# EAGLE schematic EDCPSUMK1-RP2040-USBC (EAGLE 9.6.2)
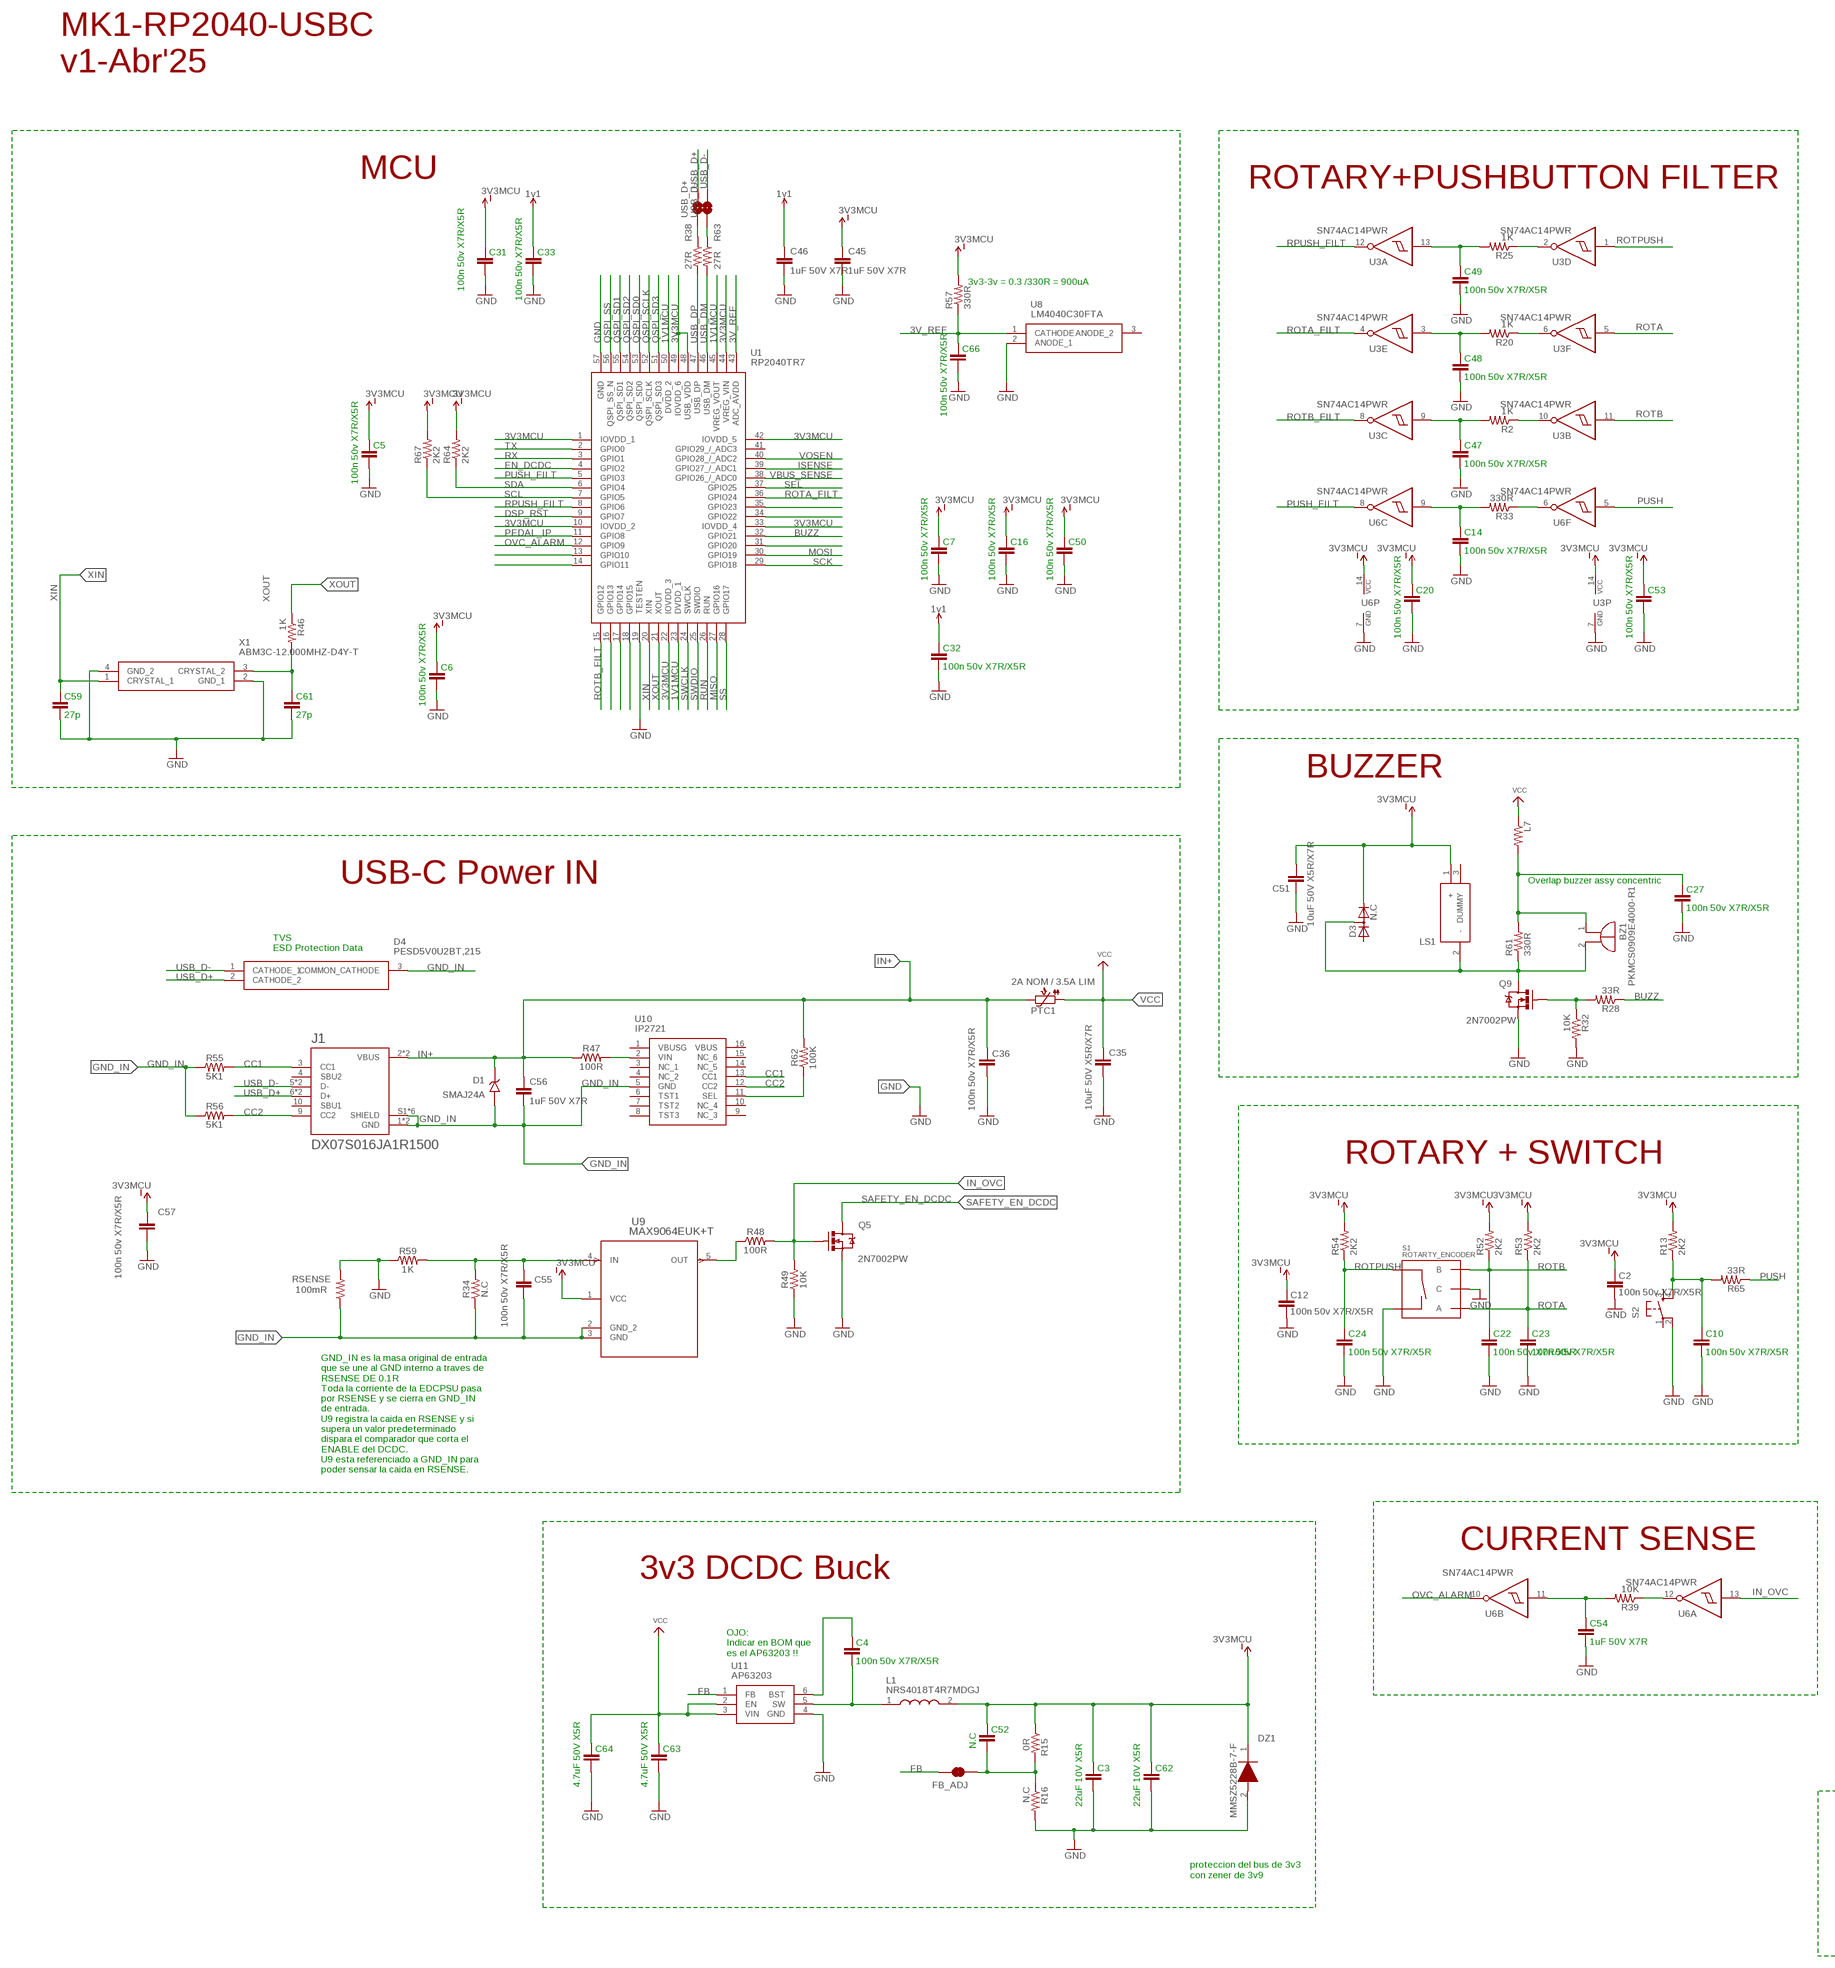
[diagram p0: schematic, sheet 1, part 1 of 2]
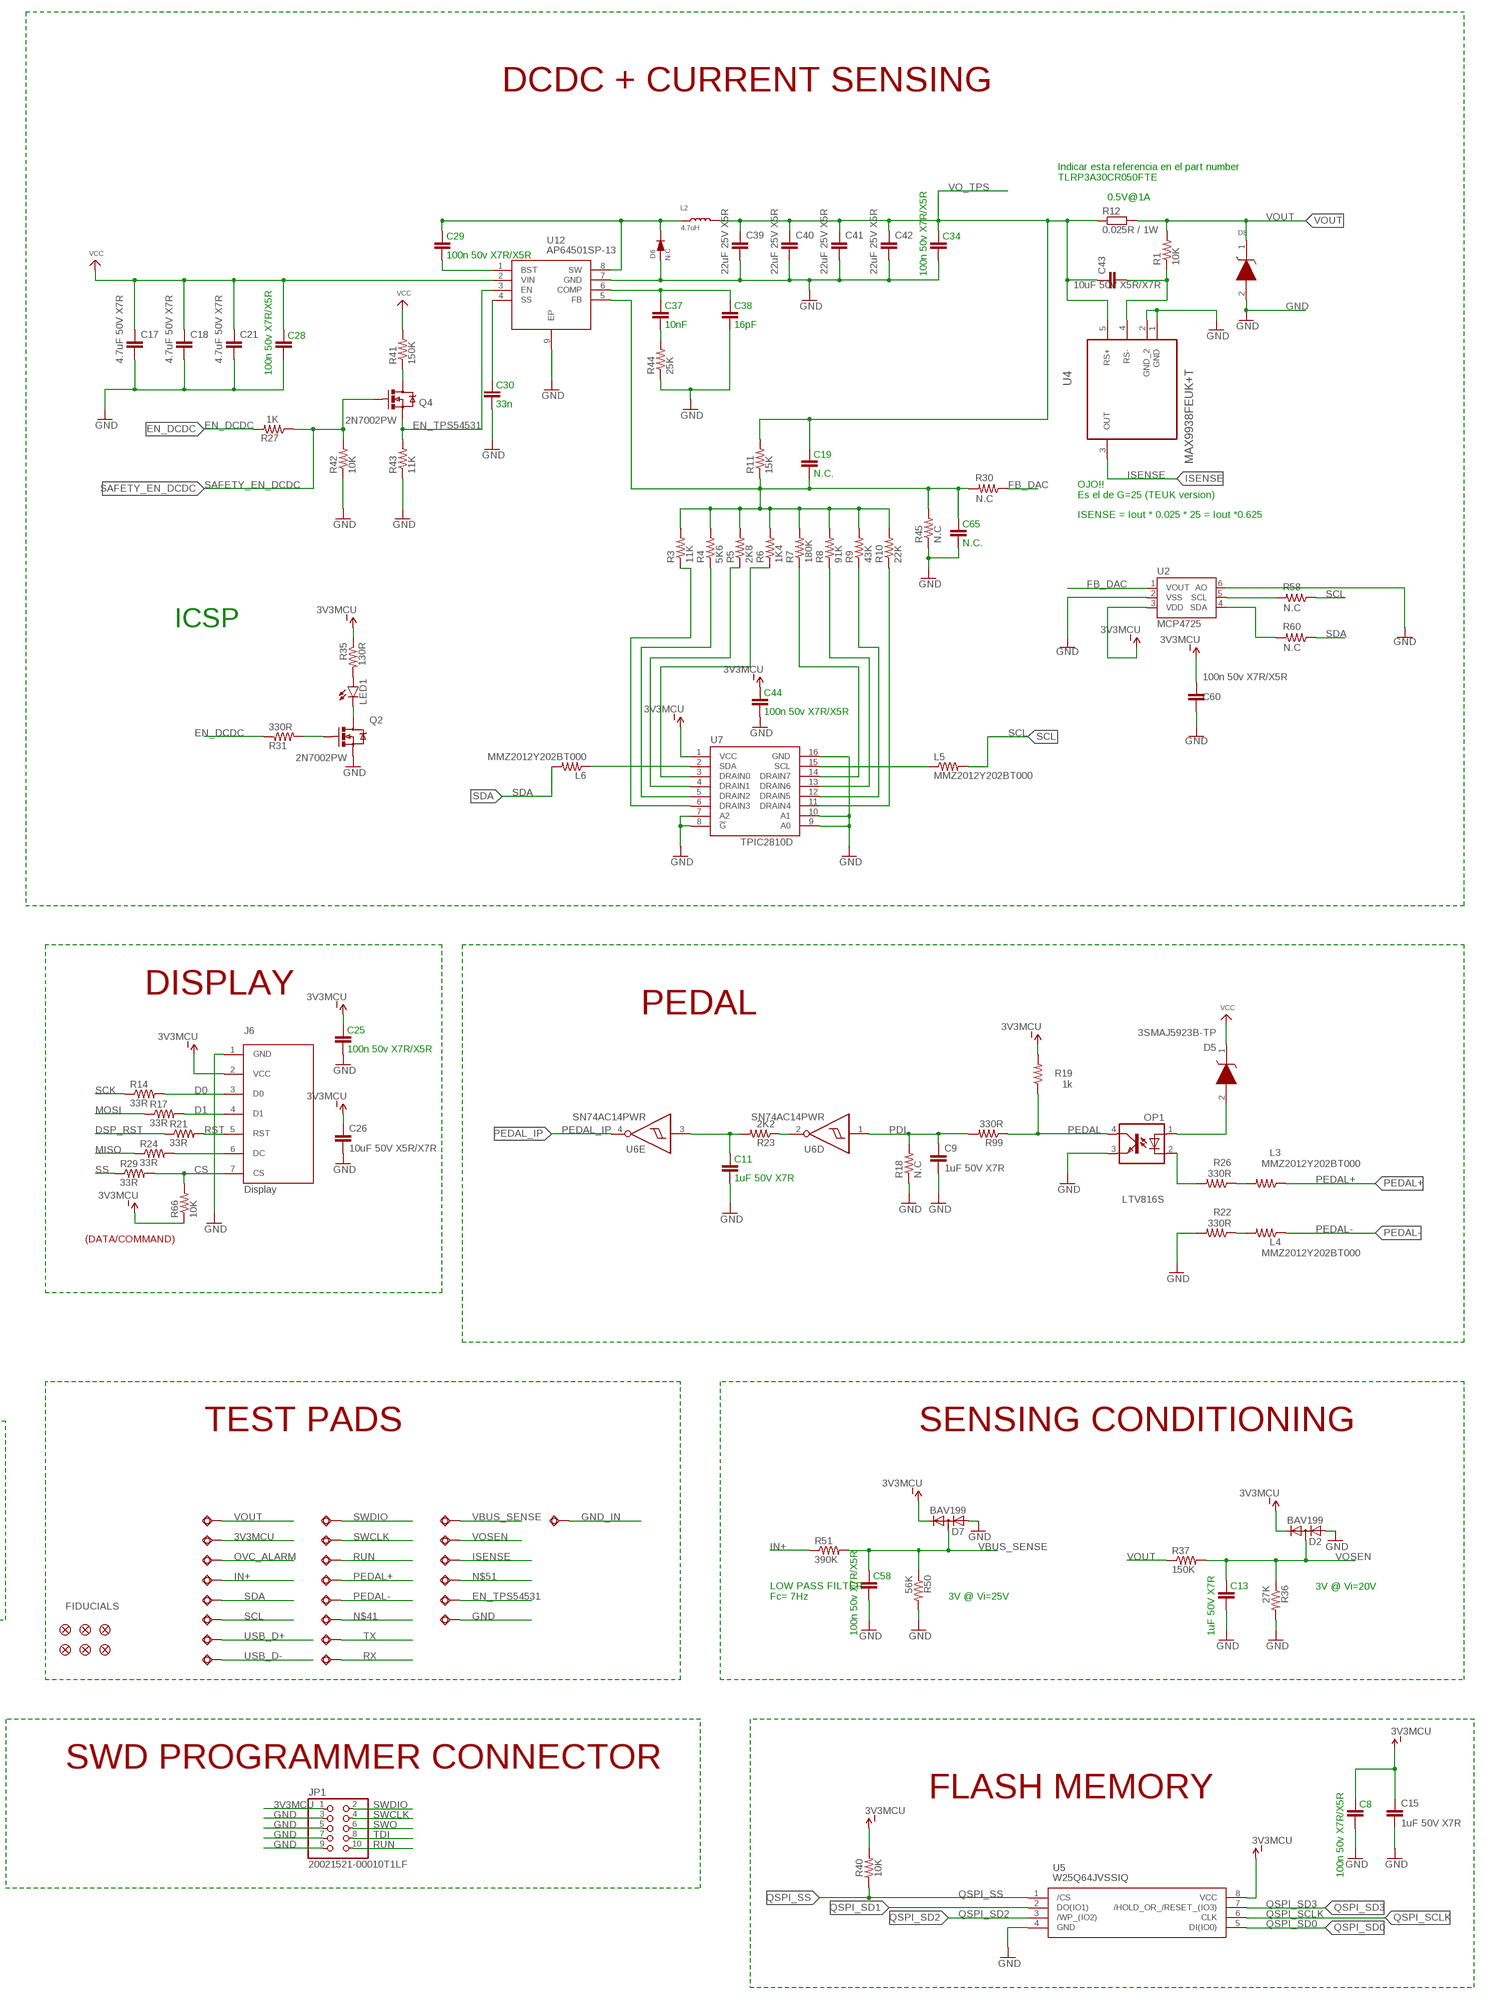
[diagram p1: schematic, sheet 1, part 2 of 2]

## Parts
3V3MCU  TESTPAD_TPSQB1,27  [TESTPAD_B1,27]
BZ1  PKMCS0909E4000-R1  [PKMCS0909]
C2  100n 50v X7R/X5R  CAP0805  [0805]
C3  22uF 10V X5R  CAP0805  [0805]
C4  100n 50v X7R/X5R  CAP0805  [0805]
C5  100n 50v X7R/X5R  CAP0805  [0805]
C6  100n 50v X7R/X5R  CAP0805  [0805]
C7  100n 50v X7R/X5R  CAP0805  [0805]
C8  100n 50v X7R/X5R  CAP0805  [0805]
C9  1uF 50V X7R  CAP0805  [0805]
C10  100n 50v X7R/X5R  CAP0805  [0805]
C11  1uF 50V X7R  CAP0805  [0805]
C12  100n 50v X7R/X5R  CAP0805  [0805]
C13  1uF 50V X7R  CAP0805  [0805]
C14  100n 50v X7R/X5R  CAP0805  [0805]
C15  1uF 50V X7R  CAP0805  [0805]
C16  100n 50v X7R/X5R  CAP0805  [0805]
C17  4.7uF 50V X7R  CAP1210  [1210]
C18  4.7uF 50V X7R  CAP1210  [1210]
C19  N.C.  CAP0805  [0805]
C20  100n 50v X7R/X5R  CAP0805  [0805]
C21  4.7uF 50V X7R  CAP1210  [1210]
C22  100n 50v X7R/X5R  CAP0805  [0805]
C23  100n 50v X7R/X5R  CAP0805  [0805]
C24  100n 50v X7R/X5R  CAP0805  [0805]
C25  100n 50v X7R/X5R  CAP0805  [0805]
C26  10uF 50V X5R/X7R  CAP1206  [1206]
C27  100n 50v X7R/X5R  CAP0805  [0805]
C28  100n 50v X7R/X5R  CAP0805  [0805]
C29  100n 50v X7R/X5R  CAP0805  [0805]
C30  33n  CAP0805  [0805]
C31  100n 50v X7R/X5R  CAP0805  [0805]
C32  100n 50v X7R/X5R  CAP0805  [0805]
C33  100n 50v X7R/X5R  CAP0805  [0805]
C34  100n 50v X7R/X5R  CAP0805  [0805]
C35  10uF 50V X5R/X7R  CAP1206  [1206]
C36  100n 50v X7R/X5R  CAP0805  [0805]
C37  10nF  CAP0805  [0805]
C38  16pF  CAP0805  [0805]
C39  22uF 25V X5R  CAP1210  [1210]
C40  22uF 25V X5R  CAP1210  [1210]
C41  22uF 25V X5R  CAP1210  [1210]
C42  22uF 25V X5R  CAP1210  [1210]
C43  10uF 50V X5R/X7R  CAP1206  [1206]
C44  100n 50v X7R/X5R  CAP0805  [0805]
C45  1uF 50V X7R  CAP0805  [0805]
C46  1uF 50V X7R  CAP0805  [0805]
C47  100n 50v X7R/X5R  CAP0805  [0805]
C48  100n 50v X7R/X5R  CAP0805  [0805]
C49  100n 50v X7R/X5R  CAP0805  [0805]
C50  100n 50v X7R/X5R  CAP0805  [0805]
C51  10uF 50V X5R/X7R  CAP1206  [1206]
C52  N.C  CAP0805  [0805]
C53  100n 50v X7R/X5R  CAP0805  [0805]
C54  1uF 50V X7R  CAP0805  [0805]
C55  100n 50v X7R/X5R  CAP0805  [0805]
C56  1uF 50V X7R  CAP0805  [0805]
C57  100n 50v X7R/X5R  CAP0805  [0805]
C58  100n 50v X7R/X5R  CAP0805  [0805]
C59  27p  CAP0805  [0805]
C60  100n 50v X7R/X5R  CAP0805  [0805]
C61  27p  CAP0805  [0805]
C62  22uF 10V X5R  CAP0805  [0805]
C63  4.7uF 50V X5R  CAP0805  [0805]
C64  4.7uF 50V X5R  CAP0805  [0805]
C65  N.C.  CAP0805  [0805]
C66  100n 50v X7R/X5R  CAP0805  [0805]
D1  SMAJ24A  3SMAJ5934B  [DIOM4325X244N]
D2  BAV199  [SOT23]
D3  N.C  BAV199  [SOT23]
D4  PESD5V0U2BT,215  [SOT95P230X110-3N]
D5  3SMAJ5923B-TP  [DIOM5226X244N]
D6  N.C  DSMC  [DO-214AB]
D7  BAV199  [SOT23]
D8  RB060M-60TR  3SMAJ5923B-TP  [DIOM5226X244N]
DZ1  MMSZ5228B-7-F  [SODFL3518X115N]
EN_TPS54531  TESTPAD_TPSQB1,27  [TESTPAD_B1,27]
FB_ADJ  JUMPER-SMT_2_NC_TRACE_NO-SILK  [SMT-JUMPER_2_NC_TRACE_NO-SILK]
FID1  FIDUCIAL1X2  [FIDUCIAL-1X2]
FID2  FIDUCIAL1X2  [FIDUCIAL-1X2]
FID3  FIDUCIAL1X2  [FIDUCIAL-1X2]
FID4  FIDUCIAL1X2  [FIDUCIAL-1X2]
FID5  FIDUCIAL1X2  [FIDUCIAL-1X2]
FID6  FIDUCIAL1X2  [FIDUCIAL-1X2]
GND  TESTPAD_TPSQB1,27  [TESTPAD_B1,27]
GND_IN  TESTPAD_TPSQB1,27  [TESTPAD_B1,27]
IN+  TESTPAD_TPSQB1,27  [TESTPAD_B1,27]
ISENSE  TESTPAD_TPSQB1,27  [TESTPAD_B1,27]
J1  DX07S016JA1R1500  [JAE_DX07S016JA1R1500]
J6  Display  OLED_LCD  [OLED_LCD]
JP1  20021521-00010T1LF  [20021521-00010T1LF]
L1  NRS4018T4R7MDGJ  [NRS4018T100MDGJ]
L2  4.7uH  L74437368047  [WE-LHMI]
L3  MMZ2012Y202BT000  RESISTOR0805-RES  [0805]
L4  MMZ2012Y202BT000  RESISTOR0805-RES  [0805]
L5  MMZ2012Y202BT000  RESISTOR0805-RES  [0805]
L6  MMZ2012Y202BT000  RESISTOR0805-RES  [0805]
L7  MMZ2012Y202BT000  RESISTOR0805-RES  [0805]
LED1  LED3MM  [LED3MM]
LS1  SMT-0540-S-R  [SMT0540SR]
N$41  TESTPAD_TPSQB1,27  [TESTPAD_B1,27]
N$51  TESTPAD_TPSQB1,27  [TESTPAD_B1,27]
OP1  LTV816S  [SMD4]
OVC_ALARM  TESTPAD_TPSQB1,27  [TESTPAD_B1,27]
PEDAL+  TESTPAD_TPSQB1,27  [TESTPAD_B1,27]
PEDAL-  TESTPAD_TPSQB1,27  [TESTPAD_B1,27]
PTC1  2A NOM / 3.5A LIM  PTC-  [1812L]
Q2  2N7002PW  MOSFET-NCHANNEL2N7002PW  [SOT323]
Q4  2N7002PW  MOSFET-NCHANNEL2N7002PW  [SOT323]
Q5  2N7002PW  MOSFET-NCHANNEL2N7002PW  [SOT323]
Q9  2N7002PW  MOSFET-NCHANNEL2N7002PW  [SOT323]
R1  10K  RESISTOR0805  [0805]
R2  1K  RESISTOR0805  [0805]
R3  11K  RESISTOR0805  [0805]
R4  5K6  RESISTOR0805  [0805]
R5  2K8  RESISTOR0805  [0805]
R6  1K4  RESISTOR0805  [0805]
R7  180K  RESISTOR0805  [0805]
R8  91K  RESISTOR0805  [0805]
R9  43K  RESISTOR0805  [0805]
R10  22K  RESISTOR0805  [0805]
R11  15K  RESISTOR0805  [0805]
R12  0.025R / 1W  RR2512  [R2512]
R13  2K2  RESISTOR0805  [0805]
R14  33R  RESISTOR0805  [0805]
R15  0R  RESISTOR0805  [0805]
R16  N.C  RESISTOR0805  [0805]
R17  33R  RESISTOR0805  [0805]
R18  N.C  RESISTOR0805  [0805]
R19  1k  RESISTOR0805  [0805]
R20  1K  RESISTOR0805  [0805]
R21  33R  RESISTOR0805  [0805]
R22  330R  RESISTOR0805  [0805]
R23  2K2  RESISTOR0805  [0805]
R24  33R  RESISTOR0805  [0805]
R25  1K  RESISTOR0805  [0805]
R26  330R  RESISTOR0805  [0805]
R27  1K  RESISTOR0805  [0805]
R28  33R  RESISTOR0805  [0805]
R29  33R  RESISTOR0805  [0805]
R30  N.C  RESISTOR0805  [0805]
R31  330R  RESISTOR0805  [0805]
R32  10K  RESISTOR0805  [0805]
R33  330R  RESISTOR0805  [0805]
R34  N.C  RESISTOR0805  [0805]
R35  130R  RESISTOR0805  [0805]
R36  27K  RESISTOR0805  [0805]
R37  150K  RESISTOR0805  [0805]
R38  27R  RESISTOR0805  [0805]
R39  10K  RESISTOR0805  [0805]
R40  10K  RESISTOR0805  [0805]
R41  150K  RESISTOR0805  [0805]
R42  10K  RESISTOR0805  [0805]
R43  11K  RESISTOR0805  [0805]
R44  25K  RESISTOR0805  [0805]
R45  N.C  RESISTOR0805  [0805]
R46  1K  RESISTOR0805  [0805]
R47  100R  RESISTOR0805  [0805]
R48  100R  RESISTOR0805  [0805]
R49  10K  RESISTOR0805  [0805]
R50  56K  RESISTOR0805  [0805]
R51  390K  RESISTOR0805  [0805]
R52  2K2  RESISTOR0805  [0805]
R53  2K2  RESISTOR0805  [0805]
R54  2K2  RESISTOR0805  [0805]
R55  5K1  RESISTOR0805  [0805]
R56  5K1  RESISTOR0805  [0805]
R57  330R  RESISTOR0805  [0805]
R58  N.C  RESISTOR0805  [0805]
R59  1K  RESISTOR0805  [0805]
R60  N.C  RESISTOR0805  [0805]
R61  330R  RESISTOR0805  [0805]
R62  100K  RESISTOR0805  [0805]
R63  27R  RESISTOR0805  [0805]
R64  2K2  RESISTOR0805  [0805]
R65  33R  RESISTOR0805  [0805]
R66  10K  RESISTOR0805  [0805]
R67  2K2  RESISTOR0805  [0805]
R99  330R  RESISTOR0805  [0805]
RSENSE  100mR  RESISTOR1206  [1206]
RUN  TESTPAD_TPSQB1,27  [TESTPAD_B1,27]
RX  TESTPAD_TPSQB1,27  [TESTPAD_B1,27]
S1  ROTARTY_ENCODER  [ROTARY_ENC_PLAIN]
S2  TAC_SWITCH_KSC931G-SMD  [TAC_SW_SMD_KSC931G]
SCL  TESTPAD_TPSQB1,27  [TESTPAD_B1,27]
SDA  TESTPAD_TPSQB1,27  [TESTPAD_B1,27]
SWCLK  TESTPAD_TPSQB1,27  [TESTPAD_B1,27]
SWDIO  TESTPAD_TPSQB1,27  [TESTPAD_B1,27]
TX  TESTPAD_TPSQB1,27  [TESTPAD_B1,27]
U1  RP2040TR7  [RP2040TR7]
U2  MCP4725  MCP4725SOT-23  [SOT23-6]
U3  SN74AC14PWR  7414  [TSSOP14]
U4  MAX9938FEUK+T  [SOT95P280X145-5N]
U5  W25Q64JVSSIQ  [SOIC127P790X216-8N]
U6  SN74AC14PWR  7414  [TSSOP14]
U7  TPIC2810D  [SO16]
U8  LM4040C30FTA  [SOT96P240X120-3N]
U9  MAX9064EUK+T  [21-0057F_MXM]
U10  IP2721  [SOP65P640X120-16N]
U11  AP63203  AP63201WU-7  [SOT95P280X100-6N]
U12  AP64501SP-13  [SOIC127P600X163-9N]
USB-D+  TESTPAD_TPSQB1,27  [TESTPAD_B1,27]
USB-D-  TESTPAD_TPSQB1,27  [TESTPAD_B1,27]
USB_D+  JUMPER-SMT_2_NO_NO-SILK  [SMT-JUMPER_2_NO_NO-SILK]
USB_D-  JUMPER-SMT_2_NO_NO-SILK  [SMT-JUMPER_2_NO_NO-SILK]
VBUS_SENSE  TESTPAD_TPSQB1,27  [TESTPAD_B1,27]
VOSEN  TESTPAD_TPSQB1,27  [TESTPAD_B1,27]
VOUT  TESTPAD_TPSQB1,27  [TESTPAD_B1,27]
X1  ABM3C-12.000MHZ-D4Y-T  [ABM3C16000MHZD4YT]

## Nets
1V1MCU: C32.2 C33.2 C46.1 U1.23(DVDD_1) U1.45(VREG_VOUT) U1.50(DVDD_2) ; supply symbol labelled 1v1
3V3MCU: 3V3MCU.TP C2.2 C3.2 C5.2 C6.2 C7.2 C8.2 C12.2 C15.1 C16.2 C20.2 C25.2 C26.1 C31.2 C44.2 C45.1 C50.2 C51.2 C52.2 C53.2 C57.1 C60.2 C62.2 D2.2(C) D3.2(C) D7.2(C) DZ1.1(K) J6.2(VCC) JP1.1 L1.2 LS1.1(+) R13.2 R15.1 R19.2 R35.1 R40.2 R52.2 R53.2 R54.2 R57.2 R64.2 R66.1 R67.2 U1.1(IOVDD_1) U1.10(IOVDD_2) U1.22(IOVDD_3) U1.33(IOVDD_4) U1.42(IOVDD_5) U1.44(VREG_VIN) U1.48(USB_VDD) U1.49(IOVDD_6) U2.3(VDD) U3.14(P:VCC) U5.8(VCC) U6.14(P:VCC) U7.1(VCC) U9.1(VCC)
3V_REF: C66.2 R57.1 U1.43(ADC_AVDD) U8.1(CATHODE)
BUZZ: R28.1 U1.32(GPIO21)
CC1: J1.3(CC1) R55.2 U10.13(CC1)
CC2: J1.9(CC2) R56.2 U10.12(CC2)
CS: J6.7(CS) R29.2 R66.2
D0: J6.3(D0) R14.2
D1: J6.4(D1) R17.2
DSP_RST: R21.1 U1.9(GPIO7)
EN_DCDC: R27.2 R31.1 U1.4(GPIO2)
EN_TPS54531: EN_TPS54531.TP Q4.2(S) R43.2 U12.3(EN)
FB: FB_ADJ.2 U11.1(FB)
FB_DAC: R30.1 U2.1(VOUT)
GND: C2.1 C3.1 C5.1 C6.1 C7.1 C8.1 C9.2 C10.1 C11.1 C12.1 C13.1 C14.1 C15.2 C16.1 C17.2 C18.2 C20.1 C21.2 C22.1 C23.1 C24.1 C25.1 C26.2 C27.1 C28.1 C30.1 C31.1 C32.1 C33.1 C34.1 C35.2 C36.1 C38.1 C39.2 C40.2 C41.2 C42.2 C44.1 C45.2 C46.2 C47.1 C48.1 C49.1 C50.1 C51.1 C53.1 C54.1 C57.2 C58.1 C59.1 C60.1 C61.1 C62.1 C63.1 C64.1 C65.1 C66.1 D2.1(A) D6.1(A) D7.1(A) D8.2(A) DZ1.2(A) GND.TP J6.1(GND) JP1.3 JP1.5 JP1.7 JP1.9 OP1.3(EMIT) Q2.2(S) Q5.2(S) Q9.2(S) R16.2 R18.1 R22.2 R32.2 R36.2 R42.1 R43.1 R44.1 R45.1 R49.1 R50.2 R59.1 RSENSE.2 S1.C S1.SW- S2.2 U1.19(TESTEN) U1.57(GND) U2.2(VSS) U2.6(AO) U3.7(P:GND) U4.1(GND) U4.2(GND_2) U5.4(GND) U6.7(P:GND) U7.7(A2) U7.8(!G) U7.9(A0) U7.10(A1) U7.16(GND) U8.2(ANODE_1) U11.4(GND) U12.7(GND) U12.9(EP) X1.2(GND_1) X1.4(GND_2)
GND_IN: C55.2 C56.2 D1.A D4.3(COMMON_CATHODE) GND_IN.TP J1.1(GND) J1.12(GND) J1.S1(SHIELD) J1.S2(SHIELD) J1.S3(SHIELD) J1.S4(SHIELD) J1.S5(SHIELD) J1.S6(SHIELD) R34.1 R55.1 R56.1 RSENSE.1 U9.2(GND_2) U9.3(GND) U10.5(GND)
IN+: C36.2 C56.1 D1.C(K) IN+.TP J1.2(VBUS) J1.11(VBUS) PTC1.2 R47.1 R51.1 R62.2
IN_OVC: Q5.1(G) R48.2 R49.2 U6.13(A:I)
ISENSE: ISENSE.TP U1.39(GPIO27_/_ADC1) U4.3(OUT)
MISO: R24.1 U1.27(GPIO16)
MOSI: R17.1 U1.30(GPIO19)
N$1: R3.1 U7.6(DRAIN3)
N$2: R4.1 U7.5(DRAIN2)
N$3: R5.1 U7.4(DRAIN1)
N$4: R6.1 U7.3(DRAIN0)
N$5: R7.1 U7.14(DRAIN7)
N$6: J6.6(DC) R24.2
N$7: R8.1 U7.13(DRAIN6)
N$8: R9.1 U7.12(DRAIN5)
N$9: R10.1 U7.11(DRAIN4)
N$10: C43.2 R1.1 U4.4(RS-)
N$11: LED1.A R35.2
N$12: LED1.K(C) Q2.3(D)
N$13: R33.1 U6.6(F:O)
N$14: R62.1 U10.11(SEL)
N$15: R39.1 U6.12(A:O)
N$16: D5.2(A) OP1.1(A)
N$17: C10.2 R13.1 R65.2 S2.4
N$18: C47.2 R2.2 U3.9(C:I)
N$19: C19.1 C65.2 R3.2 R4.2 R5.2 R6.2 R7.2 R8.2 R9.2 R10.2 R11.1 R30.2 R45.2 U12.5(FB)
N$20: Q9.1(G) R28.2 R32.1
N$21: Q2.1(G) R31.2
N$22: R2.1 U3.10(B:O)
N$23: R20.1 U3.6(F:O)
N$25: R25.1 U3.2(D:O)
N$26: C49.2 R25.2 U3.13(A:I)
N$28: C48.2 R20.2 U3.3(E:I)
N$29: C11.2 R23.2 U6.3(E:I)
N$31: BZ1.2(-) D3.3(AC) LS1.2(-) Q9.3(D) R61.1
N$32: BZ1.1(+) C27.2 L7.2 R61.2
N$34: R23.1 U6.2(D:O)
N$35: Q4.3(D) R41.1
N$37: C14.2 R33.2 U6.9(C:I)
N$38: C52.1 FB_ADJ.1 R15.2 R16.1
N$39: C54.2 R39.2 U6.11(B:I)
N$40: L6.1 U7.2(SDA)
N$41: N$41.TP OP1.2(C) R26.2
N$43: L3.2 R26.1
N$44: C30.2 U12.4(SS)
N$45: R58.2 U2.5(SCL)
N$46: L4.2 R22.1
N$47: C29.1 U12.1(BST)
N$48: R60.2 U2.4(SDA)
N$49: U1.35(GPIO23)
N$50: R47.2 U10.2(VIN)
N$51: C29.2 D6.2(K) L2.1 N$51.TP U12.8(SW)
N$52: C37.2 C38.2 U12.6(COMP)
N$53: C37.1 R44.2
N$54: L5.1 U7.15(SCL)
N$55: U1.34(GPIO22)
N$56: C4.2 U11.6(BST)
N$58: R48.1 U9.5(OUT)
N$59: C55.1 R34.2 R59.2 U9.4(IN)
N$60: U1.31(GPIO20)
N$63: C61.2 R46.2 X1.3(CRYSTAL_2)
N$64: R38.1 USB_D+.1
N$65: R63.1 USB_D-.1
N$67: C4.1 L1.1 U11.5(SW)
N$82: U1.13(GPIO10)
N$83: U1.14(GPIO11)
N$85: U1.16(GPIO13)
N$86: U1.17(GPIO14)
N$87: U1.18(GPIO15)
OVC_ALARM: OVC_ALARM.TP U1.12(GPIO9) U6.10(B:O)
PDL: C9.1 R18.2 R99.2 U6.1(D:I)
PEDAL: OP1.4(COL) R19.1 R99.1
PEDAL+: L3.1 PEDAL+.TP
PEDAL-: L4.1 PEDAL-.TP
PEDAL_IP: U1.11(GPIO8) U6.4(E:O)
PUSH: R65.1 U6.5(F:I)
PUSH_FILT: U1.5(GPIO3) U6.8(C:O)
QSPI_SCLK: U1.52(QSPI_SCLK) U5.6(CLK)
QSPI_SD0: U1.53(QSPI_SD0) U5.5(DI(IO0))
QSPI_SD1: U1.55(QSPI_SD1) U5.2(DO(IO1))
QSPI_SD2: U1.54(QSPI_SD2) U5.3(/WP_(IO2))
QSPI_SD3: U1.51(QSPI_SD3) U5.7(/HOLD_OR_/RESET_(IO3))
QSPI_SS: R40.1 U1.56(QSPI_SS_N) U5.1(/CS)
ROTA: C23.2 R53.1 S1.A U3.5(F:I)
ROTA_FILT: U1.36(GPIO24) U3.4(E:O)
ROTB: C22.2 R52.1 S1.B U3.11(B:I)
ROTB_FILT: U1.15(GPIO12) U3.8(C:O)
ROTPUSH: C24.2 R54.1 S1.SW+ U3.1(D:I)
RPUSH_FILT: U1.8(GPIO6) U3.12(A:O)
RST: J6.5(RST) R21.2
RUN: JP1.10 RUN.TP U1.26(RUN)
RX: RX.TP U1.3(GPIO1)
SAFETY_EN_DCDC: Q4.1(G) Q5.3(D) R27.1 R42.2
SCK: R14.1 U1.29(GPIO18)
SCL: L5.2 R58.1 R67.1 SCL.TP U1.7(GPIO5)
SDA: L6.2 R60.1 R64.1 SDA.TP U1.6(GPIO4)
SEL: U1.37(GPIO25)
SS: R29.1 U1.28(GPIO17)
SWCLK: JP1.4 SWCLK.TP U1.24(SWCLK)
SWDIO: JP1.2 SWDIO.TP U1.25(SWDIO)
SWO: JP1.6
TDI: JP1.8
TX: TX.TP U1.2(GPIO0)
USB_D+: D4.2(CATHODE_2) J1.6(D+) J1.7(D+) USB-D+.TP USB_D+.2
USB_D-: D4.1(CATHODE_1) J1.5(D-) J1.8(D-) USB-D-.TP USB_D-.2
USB_DM: R63.2 U1.46(USB_DM)
USB_DP: R38.2 U1.47(USB_DP)
VBUS_SENSE: C58.2 D7.3(AC) R50.1 R51.2 U1.38(GPIO26_/_ADC0) VBUS_SENSE.TP
VCC: C17.1 C18.1 C21.1 C28.2 C35.1 C63.2 C64.2 D5.1(K) L7.1 PTC1.1 R41.2 U11.2(EN) U11.3(VIN) U12.2(VIN)
VO_TPS: C19.2 C34.2 C39.1 C40.1 C41.1 C42.1 C43.1 L2.2 R11.2 R12.1 U4.5(RS+)
VOSEN: C13.2 D2.3(AC) R36.1 R37.2 U1.40(GPIO28_/_ADC2) VOSEN.TP
VOUT: D8.1(K) R1.2 R12.2 R37.1 VOUT.TP
XIN: C59.2 U1.20(XIN) X1.1(CRYSTAL_1)
XOUT: R46.1 U1.21(XOUT)
Unconnected: D3.1(A) J1.4(SBU2) J1.10(SBU1) LS1.3(DUMMY) S2.1 S2.3 U1.41(GPIO29_/_ADC3) U8.3(ANODE_2) U10.1(VBUSG) U10.3(NC_1) U10.4(NC_2) U10.6(TST1) U10.7(TST2) U10.8(TST3) U10.9(NC_3) U10.10(NC_4) U10.14(NC_5) U10.15(NC_6) U10.16(VBUS)

## Notes on the sheet
- MK1-RP2040-USBC
  v1-Abr'25
- MCU | ROTARY+PUSHBUTTON FILTER
- DCDC + CURRENT SENSING
- 3v3-3v = 0.3 /330R = 900uA
- Indicar esta referencia en el part number
  TLRP3A30CR050FTE
- 0.5V@1A
- OJO!!
  Es el de G=25 (TEUK version)
- ISENSE = Iout * 0.025 * 25 = Iout *0.625
- ICSP
- BUZZER
- USB-C Power IN | Overlap buzzer assy concentric
- TVS
  ESD Protection Data
- DISPLAY
- PEDAL
- ROTARY + SWITCH
- (DATA/COMMAND)
- GND_IN es la masa original de entrada
  que se une al GND interno a traves de
  RSENSE DE 0.1R
  Toda la corriente de la EDCPSU pasa 
  por RSENSE y se cierra en GND_IN
  de entrada.
  U9 registra la caida en RSENSE y si
  supera un valor predeterminado
  dispara el comparador que corta el 
  ENABLE del DCDC.
  U9 esta referenciado a GND_IN para
  poder sensar la caida en RSENSE.
- TEST PADS | SENSING CONDITIONING
- CURRENT SENSE
- 3v3 DCDC Buck
- OJO:
  Indicar en BOM que 
  es el AP63203 !!
- 3V @ Vi=20V
- LOW PASS FILTER
  Fc= 7Hz
- 3V @ Vi=25V
- FIDUCIALS
- SWD PROGRAMMER CONNECTOR
- FLASH MEMORY
- proteccion del bus de 3v3
  con zener de 3v9

## Library data of the parts
3V3MCU EN_TPS54531 GND GND_IN IN+ ISENSE N$41 N$51 OVC_ALARM PEDAL+ PEDAL- RUN RX SCL SDA SWCLK SWDIO TX USB-D+ USB-D- VBUS_SENSE VOSEN VOUT = BeagleBone_Blue_R3:TESTPAD_TPSQ: Test pad
BZ1 = buzzer:PKMCS0909E4000-R1: PKMCS0909E4000-R1 Source : http://www.murata.com/~/media/webrenewal/products/sound/sounder/vppt-buzj083-d.ashx
C2-C66 = SparkFun-Passives:CAP: Capacitor Standard 0603 ceramic capacitor, and 0.1" leaded capacitor.
D1 = 3SMAJ5934B:3SMAJ5934B: Check availability <https://pricing.snapeda.com/parts/3SMAJ5934B/Micro%20Commercial%20Components/view-part?ref=eda>; AVAILABILITY: Not in stock; DESCRIPTION: Zener Diode Single 24V 5% 19Ohm 3000mW 2-Pin SMA T/R; MF: Micro Commercial Components; MP: 3SMAJ5934B; PACKAGE: None; PRICE: None
D2 D3 D7 = diode:BAV199: DIODE low-leakage double diode
D4 = PESD5V0U2BT_215:PESD5V0U2BT,215: PESD5V0U2BT - Ultra low capacitance bidirectional double ESD protection diode Source: Datasheet <https://assets.nexperia.com/documents/data-sheet/PESD5V0U2BT.pdf>; ARROW_PART_NUMBER: PESD5V0U2BT,215; ARROW_PRICE-STOCK: https://www.arrow.com/en/products/pesd5v0u2bt215/nexperia?region=nac; DESCRIPTION: PESD5V0U2BT - Ultra low capacitance bidirectional double ESD protection diode; HEIGHT: 1.1mm; MANUFACTURER_NAME: Nexperia; MANUFACTURER_PART_NUMBER: PESD5V0U2BT,215; MOUSER_PART_NUMBER: 771-PESD5V0U2BTT/R; MOUSER_PRICE-STOCK: https://www.mouser.co.uk/ProductDetail/Nexperia/PESD5V0U2BT215?qs=LOCUfHb8d9uKnndgcTorSw%3D%3D
D5 D8 = 3SMAJ5923B-TP:3SMAJ5923B-TP: Zener Diodes 3W 8.2V Source: Datasheet <https://datasheet.datasheetarchive.com/originals/distributors/Datasheets_SAMA/4f01f96d86a8dc65335ad70cfcbaf461.pdf>; ARROW_PART_NUMBER: 3SMAJ5923B-TP; ARROW_PRICE-STOCK: https://www.arrow.com/en/products/3smaj5923b-tp/micro-commercial-components; DESCRIPTION: Zener Diodes 3W 8.2V; HEIGHT: 2.44mm; MANUFACTURER_NAME: MCC; MANUFACTURER_PART_NUMBER: 3SMAJ5923B-TP; MOUSER_PART_NUMBER: 833-3SMAJ5923B-TP; MOUSER_PRICE-STOCK: https://www.mouser.com/Search/Refine.aspx?Keyword=833-3SMAJ5923B-TP
D6 = EDCPSU - Rev3:D*
DZ1 = MMSZ5228B-7-F:MMSZ5228B-7-F: Diodes Inc MMSZ5228B-7-F Zener Diode, 3.9V 5% 500 mW SMT 2-Pin SOD-123 Source: Datasheet <http://au.rs-online.com/web/p/products/8231502P>; DESCRIPTION: Diodes Inc MMSZ5228B-7-F Zener Diode, 3.9V 5% 500 mW SMT 2-Pin SOD-123; HEIGHT: 1.15mm; MANUFACTURER_NAME: Diodes Inc.; MANUFACTURER_PART_NUMBER: MMSZ5228B-7-F
FB_ADJ = SparkFun-Jumpers:JUMPER-SMT_2_NC_TRACE: Normally closed trace jumper This jumper has a trace between two pads so it's normally closed (NC). Use a razor knife to open the connection. For best results follow the IPC guidelines for cutting traces: Cutout at least 0.063 mm (0.005 in). Remove all loose material to clean up the cut area. Seal the cut with an approved epoxy. Reapply solder to reclose the connection.
FID1-FID6 = SparkFun-Aesthetics:FIDUCIAL: Fiducial Alignment Points Various fiducial points for machine vision alignment.
J1 = DX07S016JA1R1500:DX07S016JA1R1500: USB-C (USB TYPE-C) USB 2.0 Receptacle Connector 24 (16+8 Dummy) Position Surface Mount, Right Angle; Through Hole; DESCRIPTION: USB-C (USB TYPE-C) USB 2.0 Receptacle Connector 24 (16+8 Dummy) Position Surface Mount, Right Angle; Through Hole; DIGI-KEY_PART_NUMBER: 670-DX07S016JA1R1500CT-ND; MF: JAE Electronics; MP: DX07S016JA1R1500; PACKAGE: None; PURCHASE-URL: https://pricing.snapeda.com/search/part/DX07S016JA1R1500/?ref=eda
J6 = EDCPSU:OLED_LCD
JP1 = 20021521-00010T1LF:20021521-00010T1LF: MINITEK 127 SHROUDED HDR Source: http://portal.fciconnect.com/Comergent//fci/drawing/20021521.pdf; DESCRIPTION: Minitek127®, Shrouded Board to Board Header, Surface Mount, 10 positions, 1.27mm (0.500in) pitch.; DIGI-KEY_PART_NUMBER: 609-4054-ND; MF: AMPHENOL ICC / FCI; MP: 20021521-00010T1LF; PACKAGE: None; PURCHASE-URL: https://pricing.snapeda.com/search/part/20021521-00010T1LF/?ref=eda
L1 = NRS4018T4R7MDGJ:NRS4018T4R7MDGJ: Inductor SMD wirewound 4.7uH Source: Datasheet <https://datasheet.datasheetarchive.com/originals/distributors/Datasheets-DGA11/2190982.pdf>; ARROW_PART_NUMBER: NRS4018T4R7MDGJ; ARROW_PRICE-STOCK: https://www.arrow.com/en/products/nrs4018t4r7mdgj/taiyo-yuden; DESCRIPTION: Inductor SMD wirewound 4.7uH; HEIGHT: 1mm; MANUFACTURER_NAME: TAIYO YUDEN; MANUFACTURER_PART_NUMBER: NRS4018T4R7MDGJ; MOUSER_PART_NUMBER: 963-NRS4018T4R7MDGJ; MOUSER_PRICE-STOCK: https://www.mouser.co.uk/ProductDetail/Taiyo-Yuden/NRS4018T4R7MDGJ?qs=PzICbMaShUfBUWy4ytltsA%3D%3D
L2 = EDCPSU - Rev3:L*
L3-L7 = SparkFun:RESISTOR: Resistor Basic schematic elements and footprints for 0603, 1206, and PTH resistors.
LED1 = SparkFun-LED:LED: LEDs Standard schematic elements and footprints for 5mm, 3mm, 1206, and 0603 sized LEDs. 5mm - Spark Fun Electronics SKU : COM-00529 (and others)
LS1 = SMT-0540-S-R:SMT-0540-S-R: Speakers & Transducers SMD TRANSDUCER 3VP-P 100MA Source: Datasheet <http://www.puiaudio.com/pdf/SMT-0540-S-R.pdf>; DESCRIPTION: Speakers & Transducers SMD TRANSDUCER 3VP-P 100MA; HEIGHT: 2mm; MANUFACTURER_NAME: PUI Audio; MANUFACTURER_PART_NUMBER: SMT-0540-S-R; MOUSER_PART_NUMBER: 665-SMT0540SR; MOUSER_PRICE-STOCK: https://www.mouser.co.uk/ProductDetail/PUI-Audio/SMT-0540-S-R?qs=e16JbV5WBEu5VaDVzQP23Q%3D%3D
OP1 = optocoupler:LTV816: OPTO COUPLER Source: LITEON, LTV816.pdf; OC_FARNELL: unknown; OC_NEWARK: unknown
PTC1 = EDCPSU:PTC-: Positive Temperature Coefficient Resistor (PTC) PTC Littlefuse 1812L200THPR - Resetteable Fuse 3.5A.pdf
Q2 Q4 Q5 Q9 = SparkFun-DiscreteSemi:MOSFET-NCHANNEL: Common NMOSFET Parts MFG P/N Store ID Prod ID FDD8780 TRANS-09984 SI7820DN TRANS-11055 FDS6630A IC-08089 2N7002PW TRANS-11151 FQP30N06L COM-10213 TRANS-10060 BSS123LT1G TRANS-08345 BSS138 TRANS-00830 BS170 2N7000; PROD_ID: TRANS-11151
R1-R11 R13-R67 R99 RSENSE = SparkFun-Resistors:RESISTOR: Generic Resistor Package
R12 = eagle-ltspice:R: RESISTOR, European symbol; SPICEMODEL: NONE; SPICEPREFIX: R
S1 = SparkFun-Electromechanical:ROTARTY_ENCODER: Simple no LED rotary encoder Example: COM-09117
S2 = EDCPSU - Rev2:TAC_SWITCH: Momentary Switch Button commonly used for reset or general input. Spark Fun Electronics SKU : COM-00097 SMT- SWCH-08247
U1 = RP2040TR7:RP2040TR7: ARM MCU, RP2040 Series Microcontrollers, ARM Cortex-M0+, 32 bit, 133 MHz, 16 MB, 56 Pins Source: Datasheet <https://componentsearchengine.com/Datasheets/2/RP2040TR7.pdf>; DESCRIPTION: ARM MCU, RP2040 Series Microcontrollers, ARM Cortex-M0+, 32 bit, 133 MHz, 16 MB, 56 Pins; HEIGHT: 0.9mm; MANUFACTURER_NAME: RASPBERRY-PI; MANUFACTURER_PART_NUMBER: RP2040TR7
U2 = SparkFun-IC-Conversion:MCP4725: MCP4725 DAC Microchip 12-bit I2C DAC, SOT23-6 Datasheet <https://cdn.sparkfun.com/datasheets/BreakoutBoards/MCP4725_2009.pdf> SparkFun Products SparkFun I2C DAC Breakout - MCP4725 <https://www.sparkfun.com/products/12918> (BOB-12918); PROD_ID: IC-08886
U3 U6 = 74xx-eu:74*14: Hex schmitt trigger INVERTER
U4 = MAX9938:MAX9938FEUK+T; DESCRIPTION: Precision Current-Sense Amplifier; MPN: MAX9938FEUK+T; OC_FARNELL: -; OC_NEWARK: 01N6733; PACKAGE: SOT-23-5; SUPPLIER: Maxim
U5 = W25Q64JVSSIQ:W25Q64JVSSIQ: 64M-bit Serial Flash Memory with uniform 4KB sectors and Dual/Quad SPI Source: Datasheet <https://www.winbond.com/hq/search-resource-file.jsp?partNo=W25Q64JVSSIQ&type=datasheet>; ARROW_PART_NUMBER: W25Q64JVSSIQ; ARROW_PRICE-STOCK: https://www.arrow.com/en/products/w25q64jvssiq/winbond-electronics?region=nac; DESCRIPTION: 64M-bit Serial Flash Memory with uniform 4KB sectors and Dual/Quad SPI; HEIGHT: 2.16mm; MANUFACTURER_NAME: Winbond; MANUFACTURER_PART_NUMBER: W25Q64JVSSIQ; MOUSER_PART_NUMBER: 454-W25Q64JVSSIQ; MOUSER_PRICE-STOCK: https://www.mouser.co.uk/ProductDetail/Winbond/W25Q64JVSSIQ?qs=qSfuJ%252Bfl%2Fd4DecxlHDmB8w%3D%3D
U7 = EDCPSU - Rev2:TPIC2810D
U8 = LM4040C30FTA:LM4040C30FTA: Diodes Inc LM4040C30FTA, Shunt Precision Voltage Reference 2.5V, 0.5%, 3-Pin SOT-23 Source: Datasheet <https://www.mouser.com/datasheet/2/115/LM4040-2681.pdf>; ARROW_PART_NUMBER: LM4040C30FTA; ARROW_PRICE-STOCK: https://www.arrow.com/en/products/lm4040c30fta/diodes-incorporated?region=nac; DESCRIPTION: Diodes Inc LM4040C30FTA, Shunt Precision Voltage Reference 2.5V, 0.5%, 3-Pin SOT-23; HEIGHT: 1.2mm; MANUFACTURER_NAME: Diodes Inc.; MANUFACTURER_PART_NUMBER: LM4040C30FTA; MOUSER_PART_NUMBER: 621-LM4040C30FTA; MOUSER_PRICE-STOCK: https://www.mouser.co.uk/ProductDetail/Diodes-Incorporated/LM4040C30FTA?qs=oUsD4qhOtFxJawR8QeoshQ%3D%3D
U9 = MAX9064:MAX9064EUK+T; COPYRIGHT: Copyright (C) 2022 Ultra Librarian. All rights reserved.; DIGI-KEY_PART_NUMBER_1: MAX9064EUK+TCT-ND; DIGI-KEY_PART_NUMBER_2: MAX9064EUK+TDKR-ND; DIGI-KEY_PART_NUMBER_3: MAX9064EUK+TTR-ND; MANUFACTURER_PART_NUMBER: MAX9064EUK+T; MFR_NAME: Maxim Integrated Products
U10 = IP2721:IP2721: TYPEC/PD2.0/PD3.0 Physical Layer IC for USB TYPEC input Interfaces Working voltage: 3V~25V Package: TSSOP16 Source: Datasheet <https://datasheet.lcsc.com/szlcsc/2006111335_INJOINIC-IP2721_C603176.pdf>; DESCRIPTION: TYPEC/PD2.0/PD3.0 Physical Layer IC for USB TYPEC input Interfaces Working voltage: 3V~25V Package: TSSOP16; HEIGHT: 1.2mm; MANUFACTURER_NAME: INJOINIC; MANUFACTURER_PART_NUMBER: IP2721
U11 = AP63201WU-7:AP63201WU-7: Switching Voltage Regulators DCDC Conv HV Buck TSOT26 T&R 3K Source: Datasheet <https://mouser.componentsearchengine.com/Datasheets/1/AP63201WU-7.pdf>; ARROW_PART_NUMBER: AP63201WU-7; ARROW_PRICE-STOCK: https://www.arrow.com/en/products/ap63201wu-7/diodes-incorporated?region=nac; DESCRIPTION: Switching Voltage Regulators DCDC Conv HV Buck TSOT26 T&R 3K; HEIGHT: 1mm; MANUFACTURER_NAME: Diodes Inc.; MANUFACTURER_PART_NUMBER: AP63201WU-7; MOUSER_PART_NUMBER: 621-AP63201WU-7; MOUSER_PRICE-STOCK: https://www.mouser.co.uk/ProductDetail/Diodes-Incorporated/AP63201WU-7?qs=u16ybLDytRaVD%252BU3eG30NA%3D%3D
U12 = AP64501SP-13:AP64501SP-13: Conv DC-DC 3.8V to 40V Synchronous Step Down Single-Out 0.8V to 39V 5A 8-Pin SO EP T/R Source: Datasheet <https://www.arrow.com/en/products/ap64501sp-13/diodes-incorporated>; ARROW_PART_NUMBER: AP64501SP-13; ARROW_PRICE-STOCK: https://www.arrow.com/en/products/ap64501sp-13/diodes-incorporated?region=nac; DESCRIPTION: Conv DC-DC 3.8V to 40V Synchronous Step Down Single-Out 0.8V to 39V 5A 8-Pin SO EP T/R; HEIGHT: 1.63mm; MANUFACTURER_NAME: Diodes Inc.; MANUFACTURER_PART_NUMBER: AP64501SP-13; MOUSER_PART_NUMBER: 621-AP64501SP-13; MOUSER_PRICE-STOCK: https://www.mouser.co.uk/ProductDetail/Diodes-Incorporated/AP64501SP-13?qs=P1JMDcb91o7FS0GU%252BW7TIQ%3D%3D
USB_D+ USB_D- = SparkFun-Jumpers:JUMPER-SMT_2_NO: Normally open jumper This jumper has two pads in close proximity to each other. Apply solder to close the connection. Round pads are easier to solder for beginners, but are a lot larger. SparkFun Product that uses the round pads: SparkFun EL Sequencer <https://www.sparkfun.com/products/12781>
X1 = ABM3C-12.000MHZ-D4Y-T:ABM3C-12.000MHZ-D4Y-T: Abracon 12MHz Crystal +/-30ppm 4-SMD, No Lead 5 x 3 x 1.3mm Source: Datasheet <https://datasheet.datasheetarchive.com/originals/distributors/Datasheets-DGA13/1171266.pdf>; ARROW_PART_NUMBER: ABM3C-12.000MHZ-D4Y-T; ARROW_PRICE-STOCK: https://www.arrow.com/en/products/abm3c-12.000mhz-d4y-t/abracon?region=nac; DESCRIPTION: Abracon 12MHz Crystal +/-30ppm 4-SMD, No Lead 5 x 3 x 1.3mm; HEIGHT: 1mm; MANUFACTURER_NAME: ABRACON; MANUFACTURER_PART_NUMBER: ABM3C-12.000MHZ-D4Y-T; MOUSER_PART_NUMBER: 815-ABM3C-12-D4YT; MOUSER_PRICE-STOCK: https://www.mouser.co.uk/ProductDetail/ABRACON/ABM3C-12.000MHZ-D4Y-T?qs=hxOQwdLlgeqaOp0z0XDuIQ%3D%3D

## Net classes
1 vcc: width 0.254 mm